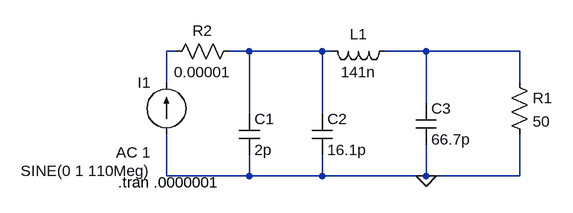
[diagram p0: schematic Problema 5 TP6.1.asc]
Problema 5 TP6.1.asc, the LTspice schematic file:
Version 4
SHEET 1 880 680
WIRE -128 64 -144 64
WIRE -16 64 -48 64
WIRE 96 64 -16 64
WIRE 112 64 96 64
WIRE 256 64 192 64
WIRE 400 64 256 64
WIRE -144 112 -144 64
WIRE 400 112 400 64
WIRE 256 144 256 64
WIRE -16 160 -16 64
WIRE 96 160 96 64
WIRE -144 256 -144 192
WIRE -16 256 -16 224
WIRE -16 256 -144 256
WIRE 96 256 96 224
WIRE 96 256 -16 256
WIRE 256 256 256 208
WIRE 256 256 96 256
WIRE 400 256 400 192
WIRE 400 256 256 256
FLAG 256 256 0
SYMBOL cap -32 160 R0
SYMATTR InstName C1
SYMATTR Value 2p
SYMBOL cap 80 160 R0
SYMATTR InstName C2
SYMATTR Value 16.1p
SYMBOL ind 208 48 R90
WINDOW 0 5 56 VBottom 2
WINDOW 3 32 56 VTop 2
SYMATTR InstName L1
SYMATTR Value 141n
SYMBOL res 384 96 R0
SYMATTR InstName R1
SYMATTR Value 50
SYMBOL cap 240 144 R0
SYMATTR InstName C3
SYMATTR Value 66.7p
SYMBOL current -144 192 R180
WINDOW 0 24 80 Left 2
WINDOW 3 24 -56 Left 2
WINDOW 123 24 -28 Left 2
WINDOW 39 0 0 Left 0
SYMATTR InstName I1
SYMATTR Value SINE(0 1 110Meg)
SYMATTR Value2 AC 1
SYMBOL res -32 48 R90
WINDOW 0 0 56 VBottom 2
WINDOW 3 32 56 VTop 2
SYMATTR InstName R2
SYMATTR Value 0.00001
TEXT -218 266 Left 2 !.tran .0000001

The netlist it stands for:
* Problema 5 TP6.1.asc
C1 N002 0 2p
C2 N002 0 16.1p
L1 N003 N002 141n
R1 N003 0 50
C3 N003 0 66.7p
I1 0 N001 SINE(0 1 110Meg) AC 1
R2 N002 N001 0.00001
.tran .0000001
.backanno
.end